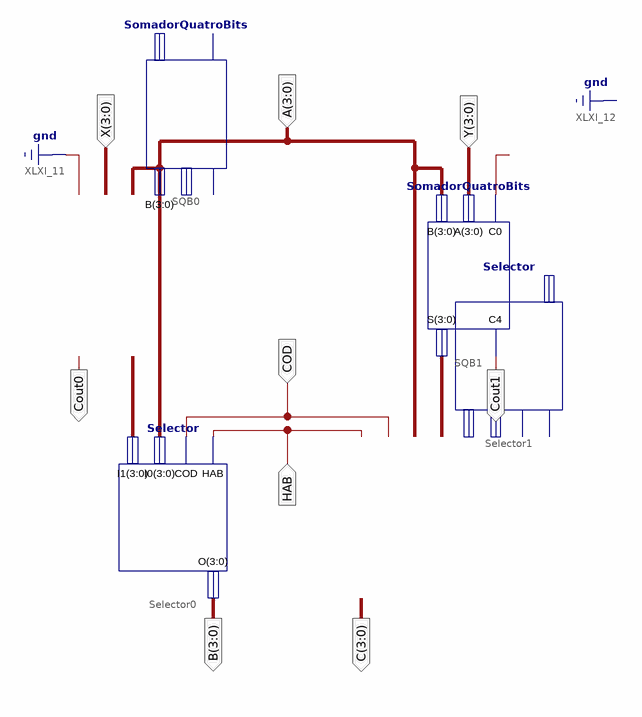
[diagram p0: schematic sheet 1]
// Xilinx ISE schematic Circuito.sch (spartan3e) as structural Verilog: 4 symbols, 9 ports
module Circuito (
  input  HAB,
  input  COD,
  input  [3:0] A,
  input  [3:0] X,
  input  [3:0] Y,
  output [3:0] B,
  output [3:0] C,
  output Cout0,
  output Cout1
);

  wire [3:0] S0, S1;

  SomadorQuatroBits SQB0 (.C0(1'b0), .A(X), .B(A), .C4(Cout0), .S(S0));
  Selector Selector0 (.HAB(HAB), .COD(COD), .I0(A), .I1(S0), .O(B));
  Selector Selector1 (.HAB(HAB), .COD(COD), .I0(A), .I1(S1), .O(C));
  SomadorQuatroBits SQB1 (.C0(1'b0), .A(Y), .B(A), .C4(Cout1), .S(S1));
endmodule
